# EAGLE design WBH2 (EAGLE 9.5.2)
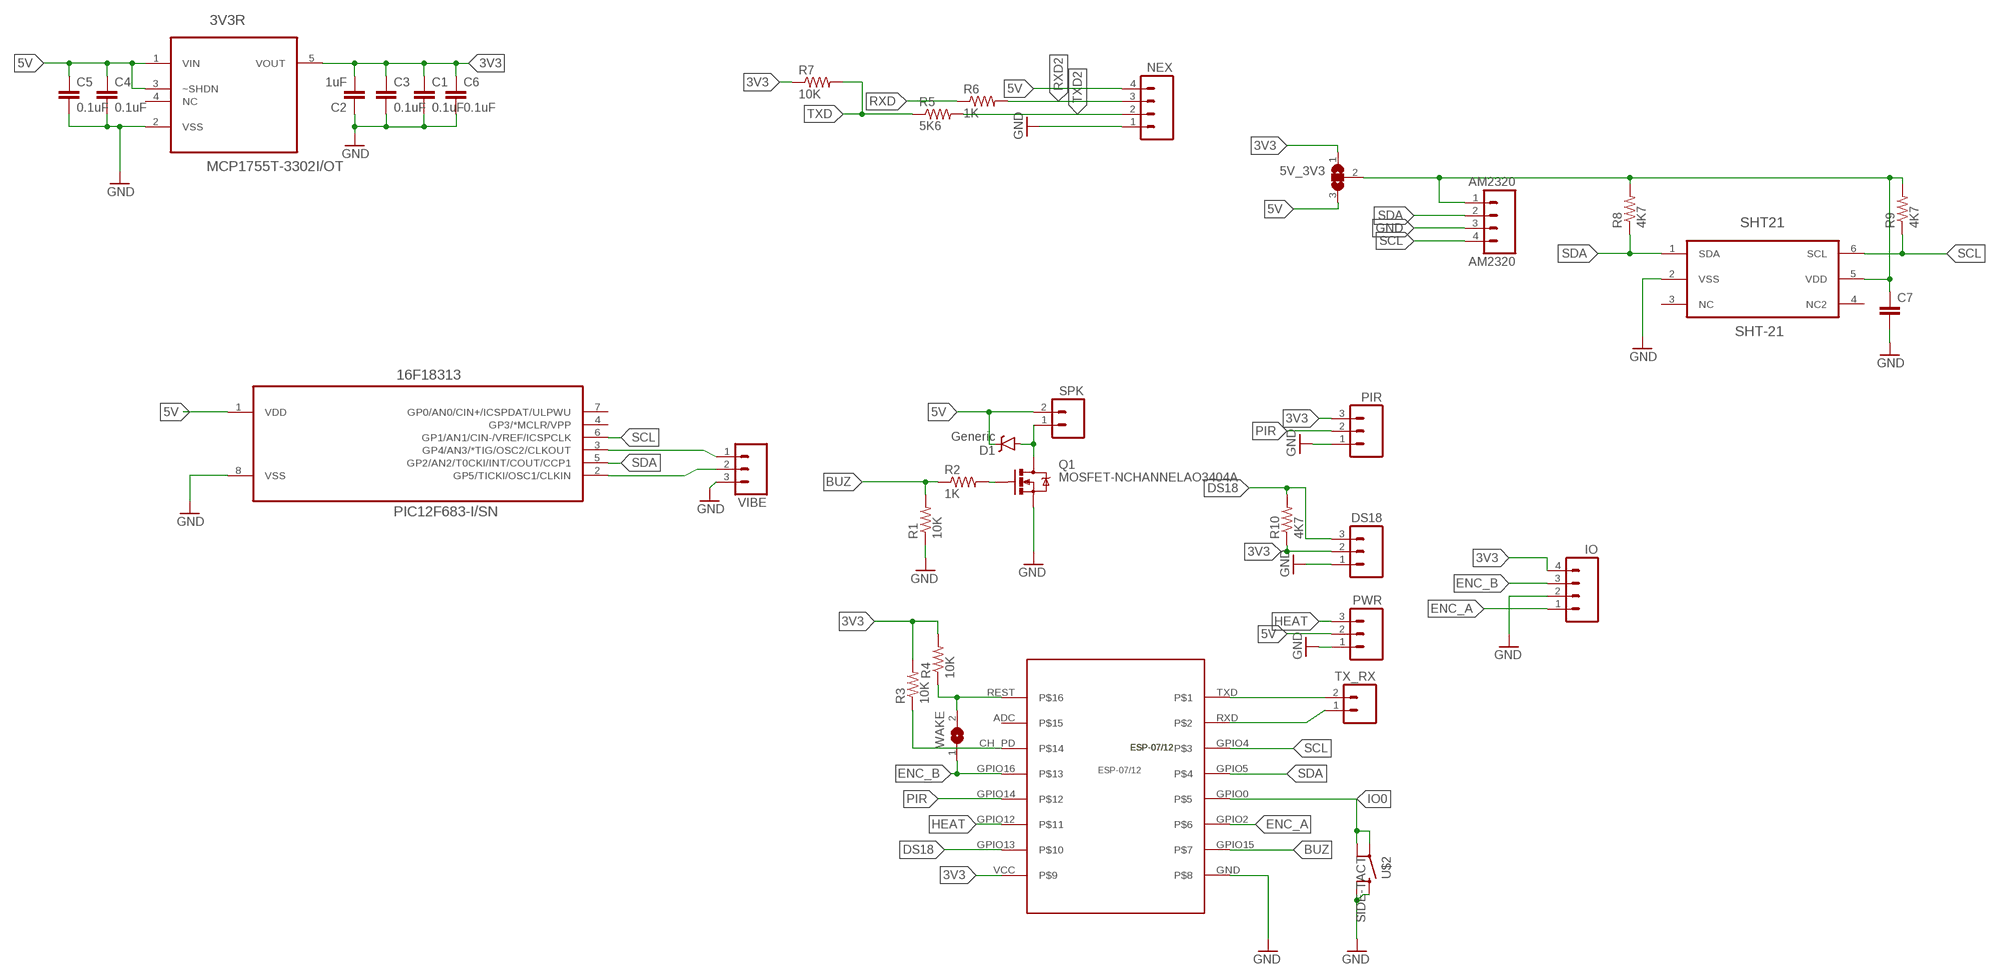
[diagram p0: schematic, sheet 1]

## Parts
3V3R  MCP1755T-3302I/OT  MCP1801T-3302I/OT  [SOT95P270X145-5N]
5V_3V3  SJ2W  [SJ_2]
16F18313  PIC12F683-I/SN  [SOIC127P600X175-8N]
AM2320  AM2320  M04PTH  [1X04]
C1  0.1uF  CAP0805  [0805]
C2  1uF  CAP0805  [0805]
C3  0.1uF  CAP0805  [0805]
C4  0.1uF  CAP0805  [0805]
C5  0.1uF  CAP0805  [0805]
C6  0.1uF  CAP0805  [0805]
C7  CAP0603-CAP  [0603-CAP]
D1  Generic  DIODE-SCHOTTKY-BAT20J  [SOD-323]
DS18  M03PTH  [1X03]
IO  M04PTH  [1X04]
NEX  M04PTH  [1X04]
PIR  M03PTH  [1X03]
PWR  M03PTH  [1X03]
Q1  MOSFET-NCHANNELAO3404A  [SOT23-3]
R1  10K  RESISTOR0805-RES  [0805]
R2  1K  RESISTOR0805-RES  [0805]
R3  10K  RESISTOR0805-RES  [0805]
R4  10K  RESISTOR0805-RES  [0805]
R5  5K6  RESISTOR0805-RES  [0805]
R6  1K  RESISTOR0805-RES  [0805]
R7  10K  RESISTOR0805-RES  [0805]
R8  4K7  RESISTOR0805-RES  [0805]
R9  4K7  RESISTOR0805-RES  [0805]
R10  4K7  RESISTOR0805-RES  [0805]
SHT21  SHT-21  [SHT21]
SPK  M02PTH  [1X02]
TX_RX  M02PTH  [1X02]
U$1  ESP-07/12  [ESP-07/12]
U$2  SIDE-TACT  [SIDE-TACT]
VIBE  M03PTH  [1X03]
WAKE  SJ  [SJ]

## Nets
3V3: 3V3R.5(VOUT) 5V_3V3.1 C1.1 C2.2 C3.1 C6.1 DS18.2 IO.4 PIR.3 R3.2 R4.2 R7.1 R10.1 U$1.VCC
5V: 3V3R.1(VIN) 3V3R.3(~SHDN) 5V_3V3.3 16F18313.1(VDD) C4.1 C5.1 D1.C NEX.4 PWR.2 SPK.2
BUZ: R1.2 R2.1 U$1.GPIO15
DS18: DS18.3 R10.2 U$1.GPIO13
ENC_A: IO.1 U$1.GPIO2
ENC_B: IO.3 U$1.GPIO16 WAKE.1
GND: 3V3R.2(VSS) 16F18313.8(VSS) AM2320.3 C1.2 C2.1 C3.2 C4.2 C5.2 C6.2 C7.2 DS18.1 IO.2 NEX.1 PIR.1 PWR.1 Q1.2(S) R1.1 SHT21.2(VSS) U$1.GND U$2.3 U$2.4 VIBE.3
HEAT: PWR.3 U$1.GPIO12
IO0: U$1.GPIO0 U$2.1 U$2.2
N$1: 16F18313.3(GP4/AN3/*TIG/OSC2/CLKOUT) VIBE.1
N$2: 16F18313.2(GP5/TICKI/OSC1/CLKIN) VIBE.2
N$3: D1.A Q1.3(D) SPK.1
N$4: Q1.1(G) R2.2
N$30: R3.1 U$1.CH_PD
PIR: PIR.2 U$1.GPIO14
PWR: 5V_3V3.2 AM2320.1 C7.1 R8.2 R9.2 SHT21.5(VDD)
REST: R4.1 U$1.REST WAKE.2
RXD: R6.1 TX_RX.1 U$1.RXD
RXD2: NEX.3 R6.2
SCL: 16F18313.6(GP1/AN1/CIN-/VREF/ICSPCLK) AM2320.4 R9.1 SHT21.6(SCL) U$1.GPIO4
SDA: 16F18313.5(GP2/AN2/T0CKI/INT/COUT/CCP1) AM2320.2 R8.1 SHT21.1(SDA) U$1.GPIO5
TXD: R5.1 R7.2 TX_RX.2 U$1.TXD
TXD2: NEX.2 R5.2
Unconnected: 3V3R.4(NC) 16F18313.4(GP3/*MCLR/VPP) 16F18313.7(GP0/AN0/CIN+/ICSPDAT/ULPWU) SHT21.4(NC2) U$1.ADC

## Power pins joined to a net without a drawn wire
NC: SHT21.3(NC)

## Library data of the parts
3V3R = Microchip_By_element14_Batch_1:MCP1801T-3302I/OT: Low Quiescent Current LDO; MPN: MCP1801T-3302I/OT; OC_FARNELL: 1578370; OC_NEWARK: 54M4830; PACKAGE: SOT-5; SUPPLIER: Microchip
5V_3V3 = jumper:SJ2W: SMD solder JUMPER
16F18313 = Microchip_By_element14_Batch_1:PIC12F683-I/SN: IC, 8BIT MCU, PIC12, 20MHZ; MPN: PIC12F683-I/SN; OC_FARNELL: 9759042; OC_NEWARK: 61K3434; PACKAGE: SOIC-8; SUPPLIER: MICROCHIP
AM2320 IO NEX = SparkFun-Connectors:M04: Header 4 Standard 4-pin 0.1" header. Use with straight break away headers (SKU : PRT-00116), right angle break away headers (PRT-00553), swiss pins (PRT-00743), machine pins (PRT-00117), and female headers (PRT-00115). Molex polarized connector foot print use with SKU : PRT-08231 with associated crimp pins and housings. 1MM SMD Version SKU: PRT-10208; PROD_ID: CONN-09696
C1-C7 = SparkFun-Capacitors:CAP: Capacitor Standard 0603 ceramic capacitor, and 0.1" leaded capacitor.
D1 = SparkFun-DiscreteSemi:DIODE-SCHOTTKY: Schottky diodes in SFE's production catalog BAT20J 1A 23V 0.62Vf RB751 120mA 40V 0.37Vf PMEG4005EJ 0.5A 40V 0.42Vf MBRA140 1A 40V 0.5Vf B340A 3A 40V SMA; PROD_ID: DIO-11623; VALUE: BAT20J
DS18 PIR PWR VIBE = SparkFun-Connectors:M03: Header 3 Standard 3-pin 0.1" header. Use with straight break away headers (SKU : PRT-00116), right angle break away headers (PRT-00553), swiss pins (PRT-00743), machine pins (PRT-00117), and female headers (PRT-00115). Molex polarized connector foot print use with SKU : PRT-08232 with associated crimp pins and housings.
Q1 = SparkFun-DiscreteSemi:MOSFET-NCHANNEL: Common NMOSFET Parts MFG P/N Store ID Prod ID FDD8780 TRANS-09984 SI7820DN TRANS-11055 FDS6630A IC-08089 2N7002PW TRANS-11151 FQP30N06L COM-10213 TRANS-10060 BSS123LT1G TRANS-08345 BSS138 TRANS-00830 BS170 2N7000; PROD_ID: TRAN-12988
R1-R10 = SparkFun-Resistors:RESISTOR: Resistor Basic schematic elements and footprints for 0603, 1206, and PTH resistors.
SHT21 = CuriousTech:SHT-21
SPK TX_RX = SparkFun-Connectors:M02: Standard 2-pin 0.1" header. Use with - straight break away headers ( PRT-00116) - right angle break away headers (PRT-00553) - swiss pins (PRT-00743) - machine pins (PRT-00117) - female headers (PRT-00115) Molex polarized connector foot print use with: PRT-08233 with associated crimp pins and housings. 2.54_SCREWTERM for use with PRT-10571. 3.5mm Screw Terminal footprints for PRT-08084 5mm Screw Terminal footprints for use with PRT-08432
U$1 = ESP-07_12:ESP-07/12: Version 1.0 of the library for the ESP-07/12 full GPIO dev board module byME Jon jonnyradu@gmail.com
U$2 = CuriousTech:SIDE-TACT
WAKE = jumper:SJ: SMD solder JUMPER

## Board
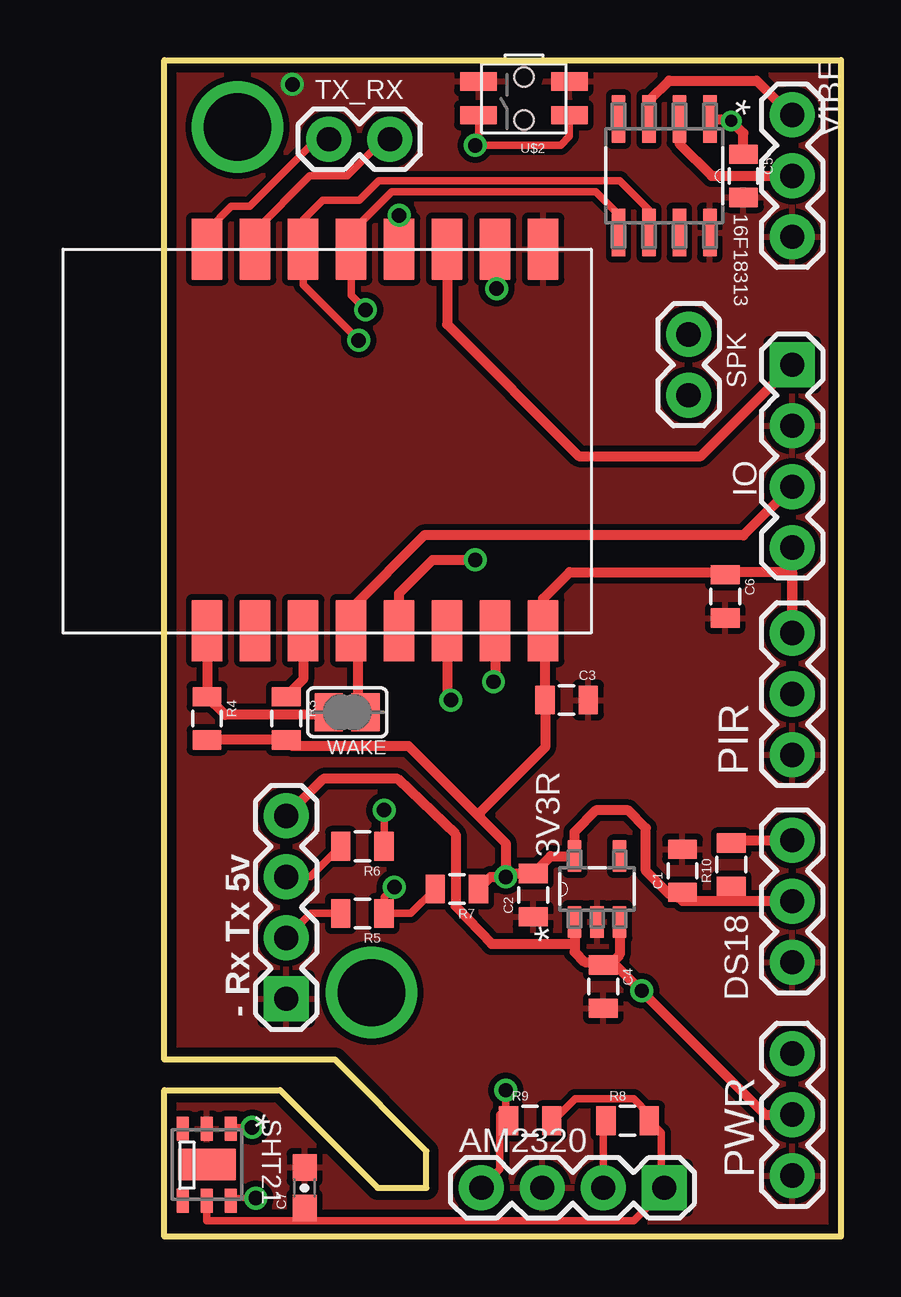
[diagram p1: board, top side]
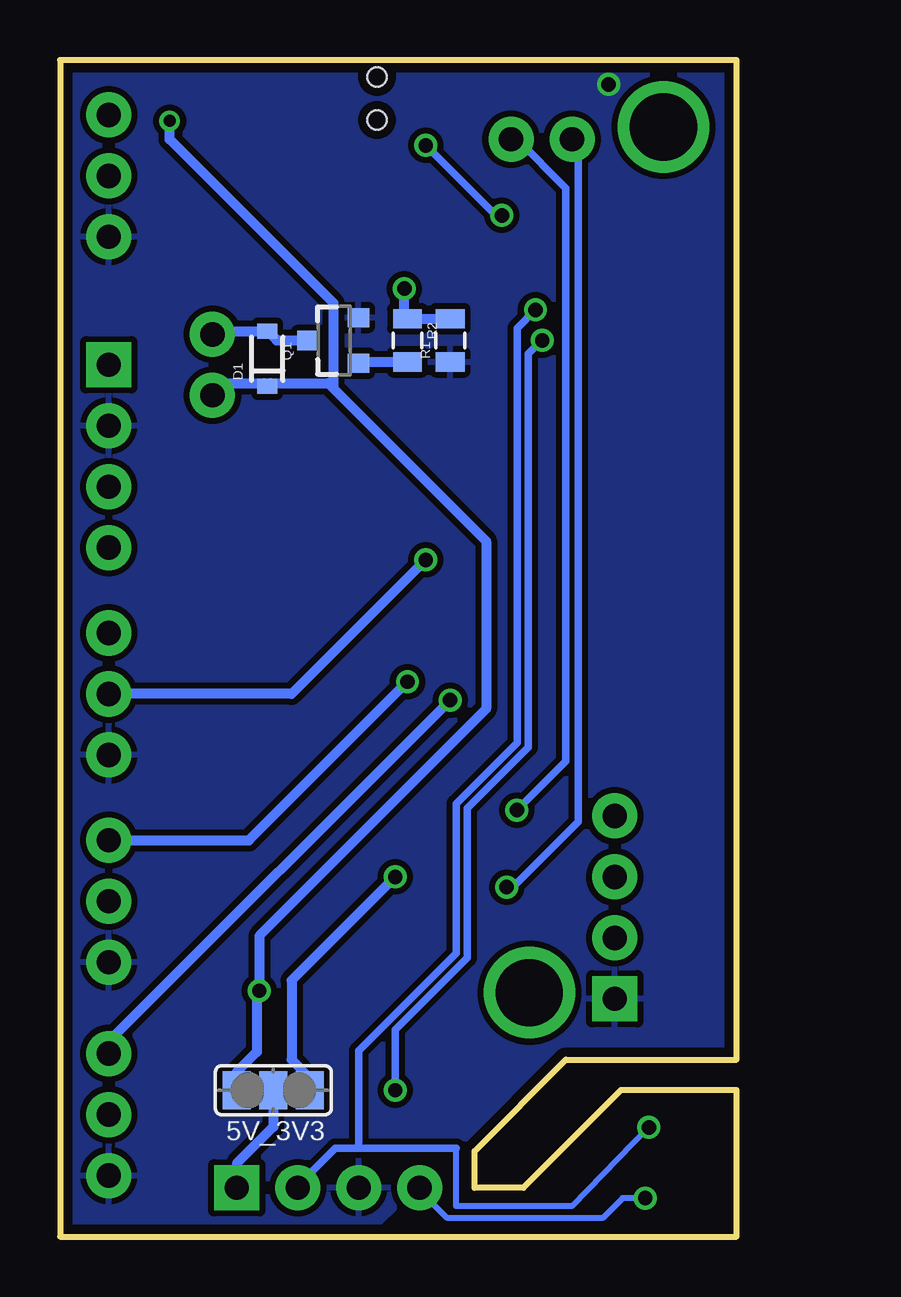
[diagram p2: board, bottom side, seen from below]

Size 28.19 x 49.02 mm. Coordinates in mm from the lower left corner, seen from the top.
Outline: 28.19,0 0,0 0,6.1 4.83,6.1 8.89,2.03 10.92,2.03 10.92,3.56 7.11,7.37 0,7.37 0,49.02 28.19,49.02 28.19,0
Copper layers (1*16): Top 0.0356mm / dielectric 1.5011mm / Bottom 0.0356mm
Design rules "LaenPCBOrder *": minimum track width 6mil, minimum drill 13mil, track to track 6mil, track to pad 6mil, pad to pad 6mil, via to via 6mil, smd to smd 6mil, copper to edge 15mil, drill to drill 6mil, minimum pad ring 7mil, minimum via ring 7mil, stop-mask expansion 4mil, vias tented up to drill 0mil, thermal gap 10mil

### Footprints (pad centres in the part's own frame; a part is rotated, then mirrored left to right if it is on the bottom)
SOT95P270X145-5N = smd 1.321 x 0.559: 1 -1.372,0.94; 2 -1.372,0; 3 -1.372,-0.94; 4 1.372,-0.94; 5 1.372,0.94
SJ_2 = smd 1.168 x 1.6: 1 -1.524,0; 2 0,0; 3 1.524,0
SOIC127P600X175-8N = smd 1.981 x 0.559: 1 -2.362,1.905; 2 -2.362,0.635; 3 -2.362,-0.635; 4 -2.362,-1.905; 5 2.362,-1.905; 6 2.362,-0.635; 7 2.362,0.635; 8 2.362,1.905
1X04 = drill 1.016 pad 1.88 square: 1 0,0 | drill 1.016 pad 1.88: 2 2.54,0; 3 5.08,0; 4 7.62,0
0805 = smd 0.8 x 1.2: 1 -0.9,0; 2 0.9,0
0603-CAP = smd 1.1 x 1: 1 -0.85,0; 2 0.85,0
SOD-323 = smd 0.63 x 0.83: A 1.15,0; C -1.15,0
1X03 = drill 1.016 pad 1.88: 1 0,0; 2 2.54,0; 3 5.08,0
SOT23-3 = smd 0.8 x 0.9: 1 -0.95,-1; 2 0.95,-1; 3 0,1.1
SHT21 = smd 1 x 0.5: 1 -1.5,1; 2 -1.5,0; 3 -1.5,-1; 4 1.5,-1; 5 1.5,0; 6 1.5,1 | smd 1.3 x 2.4: P$1 0,0
1X02 = drill 1.016 pad 1.88: 1 0,0; 2 2.54,0
ESP-07/12 = smd 2.54 x 1.27: ADC 0.1,14; CH_PD 0.1,12; GND 16,2; GPIO0 16,8; GPIO2 16,6; GPIO4 16,12; GPIO5 16,10; GPIO12 0.1,6; GPIO13 0.1,4; GPIO14 0.1,8; GPIO15 16,4; GPIO16 0.1,10; REST 0.1,16; RXD 16,14; TXD 16,16; VCC 0.1,2
SIDE-TACT = smd 1.524 x 0.762: 1 -1.894,0.705; 2 1.894,0.705; 3 -1.894,-0.705; 4 1.894,-0.705 | hole 0.8: 0,0.9; 0,-0.9
SJ = smd 1.168 x 1.6: 1 -0.762,0; 2 0.762,0

### Placement (x,y rotation side)
3V3R  18.03,14.48 90 top
5V_3V3  19.3,6.1 180 bottom
16F18313  20.83,44.2 270 top
AM2320  20.83,2.03 180 top
C1  21.59,15.24 90 top
C2  15.37,14.22 90 top
C3  16.76,22.35 0 top
C4  18.29,10.41 270 top
C5  24.13,44.2 270 top
C6  23.37,26.67 270 top
C7  5.84,2.03 90 top
D1  19.56,36.58 90 bottom
DS18  26.16,11.43 90 top
IO  26.16,36.32 270 top
NEX  5.08,9.91 90 top
PIR  26.16,20.07 90 top
PWR  26.16,2.54 90 top
Q1  16.76,37.34 90 bottom
R1  11.94,37.34 90 bottom
R2  13.72,37.34 270 bottom
R3  5.08,21.59 270 top
R4  1.78,21.59 270 top
R5  8.26,13.46 180 top
R6  8.26,16.26 180 top
R7  12.19,14.48 180 top
R8  19.3,4.83 0 top
R9  15.24,4.83 0 top
R10  23.62,15.49 90 top
SHT21  1.78,3 270 top
SPK  21.84,37.59 270 top
TX_RX  9.4,45.72 180 top
U$1  17.78,25.15 90 top
U$2  14.99,47.42 180 top
VIBE  26.16,46.74 270 top
WAKE  7.62,21.84 180 top

### Tracks (layer width: path | path; a pad name or v marks a point on that pad's centre or on a via)
3V3  (via drill 0.6)
  Top 0.305: C6.1 23.37,27.69 | C1.1 21.59,13.97
  Top 0.406: v14.22,14.99 14.36,15.12 C2.2 16.09,15.85 3V3R.5 17.09,16.87 17.98,17.75 19.33,17.75 20.07,17.02 20.07,15.24 21.08,14.22 21.84,13.97 | DS18.2 23.62,13.97 | 23.62,13.97 21.84,13.97 | 21.84,13.97 21.59,13.97 | IO.4 PIR.3 26.16,27.69 23.37,27.69 16.89,27.69 15.78,26.58 U$1.VCC 15.86,25.25 C3.1 15.86,20.38 13.15,17.67 13.15,17.47 | R4.2 R3.2 5.33,20.44 10.18,20.44 13.15,17.47 | v14.22,14.99 14.22,16.39 13.15,17.47 | R7.1 13.6,14.99 v14.22,14.99 | R10.1 23.62,13.97
  Bottom 0.406: 5V_3V3.1 17.78,6.6 18.54,7.37 18.54,10.67 v14.22,14.99
5V  (via drill 0.5, 0.6)
  Top 0.406: 19.87,10.24 25.03,5.08 PWR.2 | 18.54,11.31 C4.1 18.14,11.47 18.1,11.43 17.53,11.43 17.09,11.86 17.09,12.19 | 18.54,11.31 18.8,11.31 19.87,10.24 | v19.89,10.24 19.87,10.24 | 3V3R.1 17.09,12.19 | 3V3R.3 18.97,11.75 18.54,11.31 | C5.1 24.13,45.97 v23.62,46.48 23.55,46.56 16F18313.1 | 17.09,12.19 13.64,12.19 12.14,13.77 12.14,16.75 9.72,19.07 6.62,19.07 NEX.4
  Bottom 0.406: 5V_3V3.3 20.83,6.86 19.99,7.7 19.99,10.14 v19.89,10.24 19.89,12.53 10.44,21.98 10.44,28.98 16.8,35.34 | 16.8,35.34 16.8,38.9 23.62,45.72 v23.62,46.48 | SPK.2 21.34,35.56 19.69,35.56 D1.C 19.42,35.56 17.02,35.56 16.8,35.34
BUZ  (via drill 0.6)
  Top 0.406: U$1.GPIO15 13.78,39.69 13.72,39.62 v13.84,39.5
  Bottom 0.406: v13.84,39.5 13.84,38.37 R2.1 R1.2
DS18  (via drill 0.6)
  Top 0.406: U$1.GPIO13 13.78,23.18 v13.72,23.11 | R10.2 23.74,16.51 DS18.3
  Bottom 0.406: DS18.3 20.32,16.51 v13.72,23.11
ENC_A
  Top 0.406: IO.1 22.35,32.51 17.27,32.51 11.78,38 U$1.GPIO2
ENC_B
  Top 0.406: IO.3 24.13,29.21 10.83,29.21 7.78,26.16 U$1.GPIO16 7.78,24.33 8.05,24.06 8.05,22.17 WAKE.1
GND  (via drill 0.6)
  other vias: 5.33,48.01
  pour Top (isolate 0.254): 0,1.27 15.24,1.27 16.51,0 28.45,0 28.45,49.28 0,49.28
  pour Bottom (isolate 0.254): 28.45,49.28 28.45,0 15.48,0 7.86,7.37 0,7.37 0,49.28
HEAT  (via drill 0.6)
  Top 0.406: U$1.GPIO12 11.78,22.51 v11.94,22.35
  Bottom 0.406: PWR.3 26.16,8.13 v11.94,22.35
IO0  (via drill 0.6)
  Top 0.305: v9.78,42.55 U$1.GPIO0 | U$2.2 13.09,45.6 v12.95,45.47 16.51,45.47 16.88,45.84 U$2.1
  Bottom 0.305: v12.95,45.47 10.03,42.55 v9.78,42.55
N$1
  Top 0.406: VIBE.1 26.11,46.74 24.68,48.16 21.04,48.16 20.19,47.31 16F18313.3
N$2
  Top 0.406: 16F18313.2 21.46,45.54 22.81,44.2 VIBE.2
N$3
  Bottom 0.406: SPK.1 21.71,37.73 D1.A 19.17,37.34 Q1.3
N$4
  Bottom 0.406: R2.2 15.71,36.44 Q1.1
N$5  (via drill 2.8)
  other vias: 8.64,10.16
N$8  (via drill 2.8)
  other vias: 3.05,46.23
N$30
  Top 0.406: U$1.CH_PD 5.78,23.21 5.08,22.51 R3.1
PIR  (via drill 0.6)
  Top 0.406: U$1.GPIO14 9.78,26.8 11.18,28.19 v12.95,28.19
  Bottom 0.406: PIR.2 18.54,22.61 v12.95,28.19
PWR
  Top 0.305: SHT21.5 1.78,0.66 5.59,0.66 | 5.59,0.66 19.56,0.66 20.83,1.93 AM2320.1 | C7.1 5.59,1.18 5.59,0.66 | 20.71,2.05 20.71,4.32 R8.2 20.2,5.08 19.55,5.73 17.12,5.73 16.21,4.83 R9.2
  Top 0.406: 20.71,2.05 20.83,1.93
  Bottom 0.406: 5V_3V3.2 19.3,4.57 20.83,3.05 AM2320.1
REST
  Top 0.406: U$1.REST R4.1 2.53,21.73 6.59,21.73 6.7,21.84 WAKE.2
RXD  (via drill 0.6)
  Top 0.305: U$1.RXD 3.78,41.91 6.07,44.19 7.62,44.19 9.14,45.72 TX_RX.1 | v9.15,17.77 R6.1
  Bottom 0.305: TX_RX.1 9.14,45.72 7.11,43.69 7.11,19.81 v9.15,17.77
RXD2
  Top 0.305: R6.2 6.08,14.99 NEX.3
SCL  (via drill 0.6)
  Top 0.254: v3.81,1.6 2.88,1.6 SHT21.6
  Top 0.305: AM2320.4 13.97,2.79 13.97,5.08 14.54,5.08 R9.1 14.22,4.93 v14.22,6.1 | 16F18313.6 20.19,42.77 18.98,43.99 8.94,43.99 8.13,43.18 6.6,43.18 5.78,42.36 U$1.GPIO4 5.78,39.66 v8.1,37.34
  Bottom 0.254: v3.81,1.6 4.75,1.6 5.58,0.77 12.05,0.77 13.21,1.93
  Bottom 0.305: 13.21,1.93 AM2320.4 | v8.1,37.34 8.13,37.34 8.69,36.78 8.69,20.39 11.23,17.84 11.23,11.61 14.22,8.61 v14.22,6.1
SDA  (via drill 0.6)
  Top 0.254: v3.66,4.55 2.83,4.55
  Top 0.305: 2.83,4.55 SHT21.1 | R8.1 18.29,4.71 AM2320.2 | 16F18313.5 18.92,42.6 17.99,43.53 9.48,43.53 7.85,41.91 7.62,41.91 7.62,41.31 U$1.GPIO5 7.78,39.21 v8.38,38.61
  Bottom 0.254: v3.66,4.55 6.86,1.27 11.68,1.27 11.68,3.67
  Bottom 0.305: 15.75,3.67 15.75,7.74 11.68,11.8 11.68,18.03 9.14,20.57 9.14,37.85 v8.38,38.61 | AM2320.2 18.29,2.11 16.72,3.67 15.75,3.67 | 11.68,3.67 15.75,3.67
TXD  (via drill 0.6)
  Top 0.305: TX_RX.2 6.35,45.72 3.56,42.93 2.79,42.93 1.78,41.91 U$1.TXD | R7.2 10.28,13.46 R5.1 9.15,14.13 v9.58,14.56
  Bottom 0.305: v9.58,14.56 9.33,14.56 6.6,17.28 6.6,45.47 TX_RX.2
TXD2
  Top 0.305: R5.2 6.1,13.46 NEX.2

### Text on the board
tPlace: - Rx Tx 5v
tStop: ESP-07
bStop: CuriousTech.net